# EAGLE design RCS (EAGLE 9.6.2)
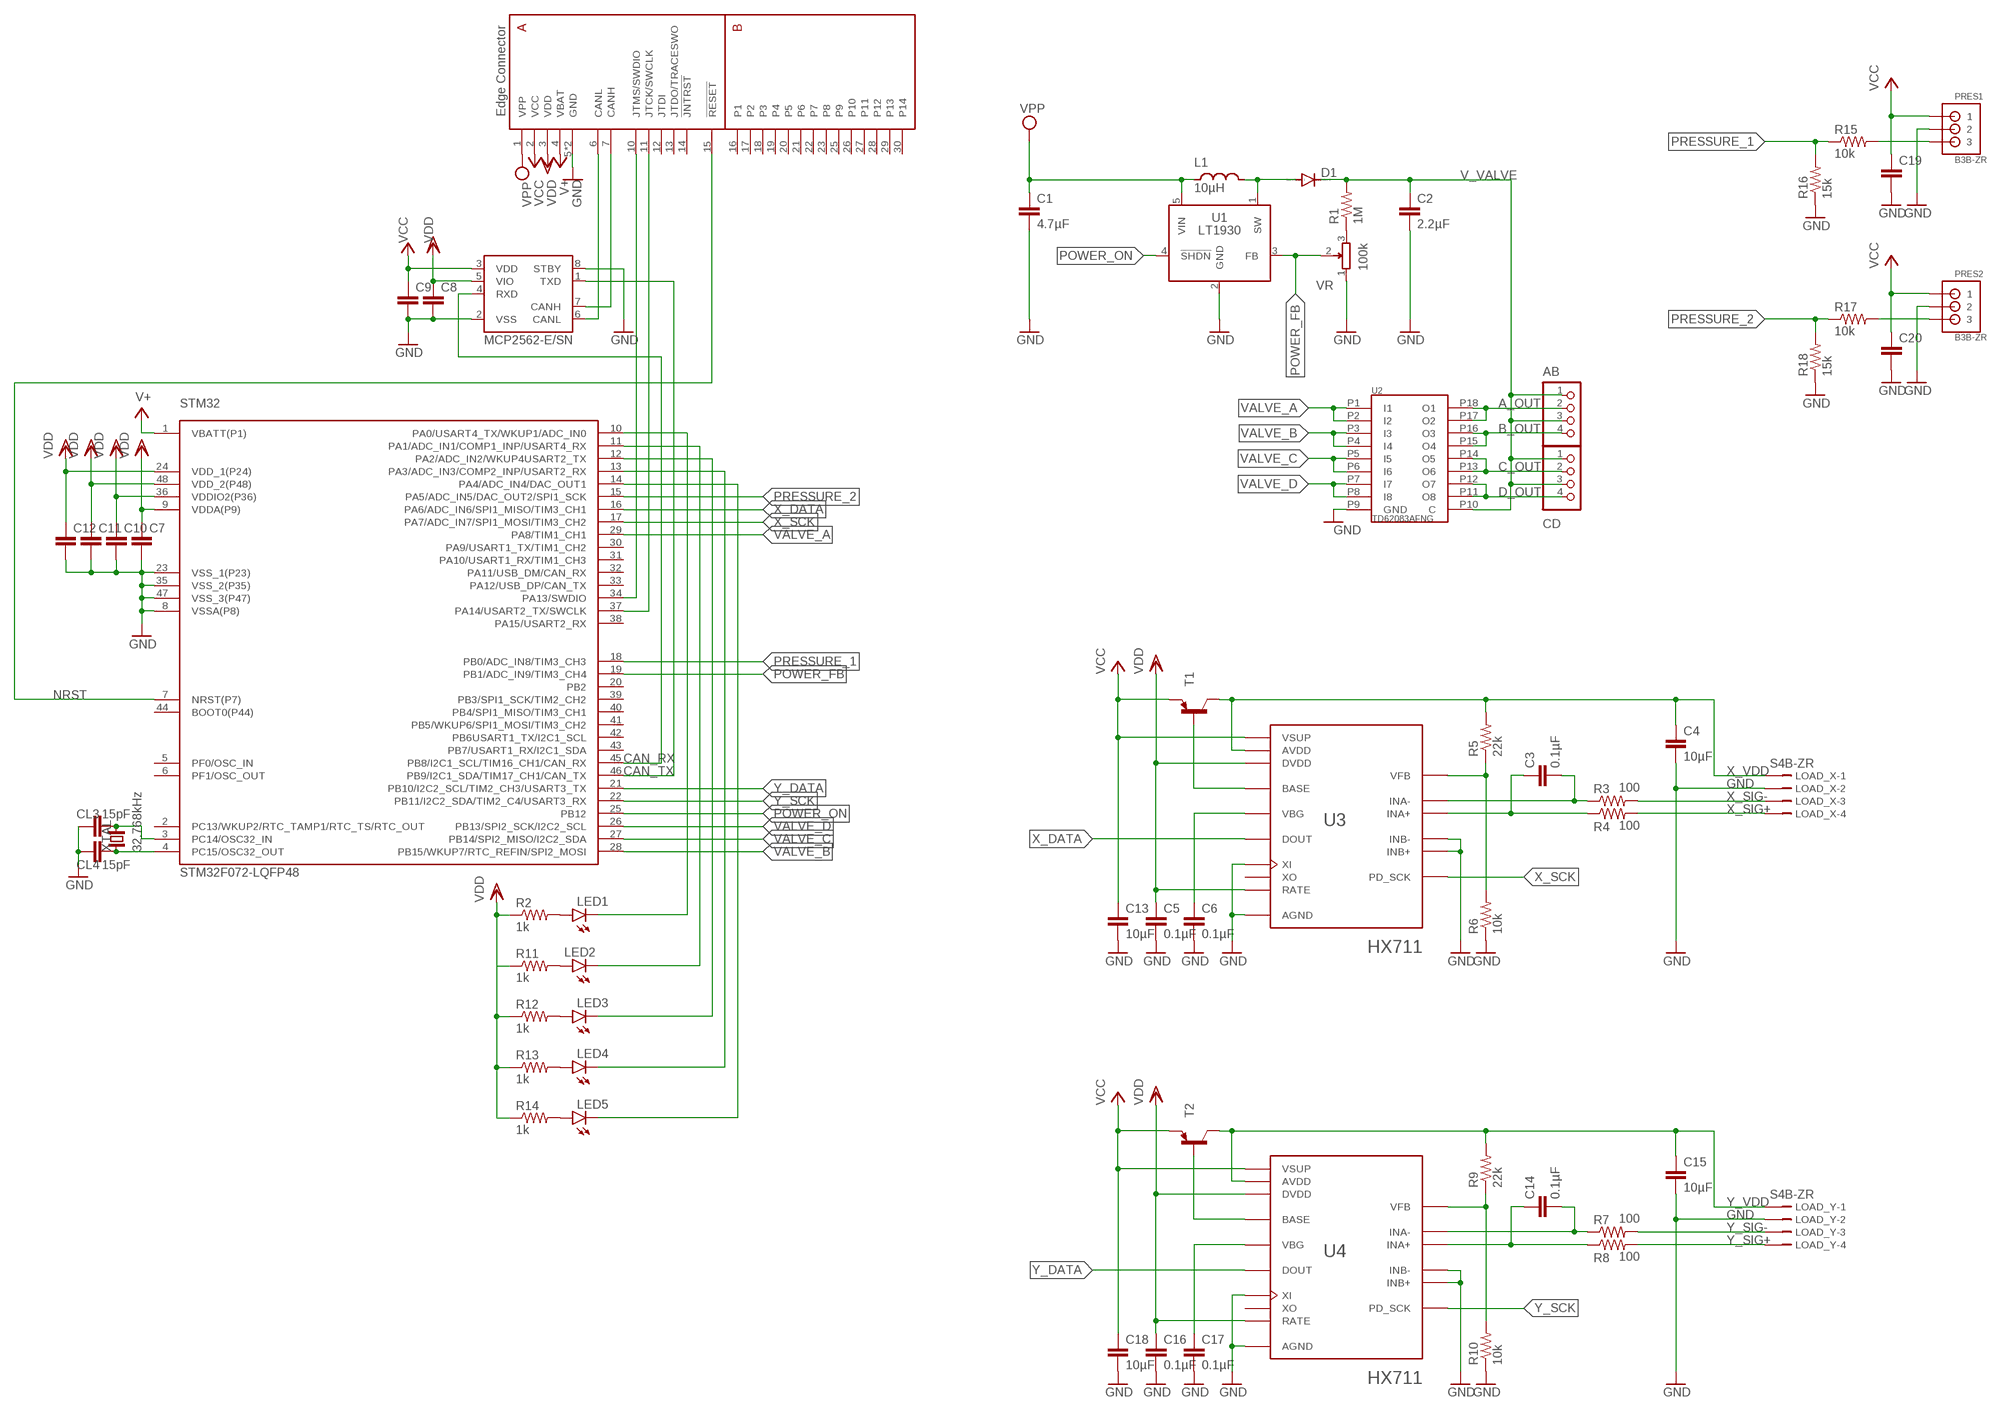
[diagram p0: schematic, sheet 1]

## Parts
AB  S4B-PH-K-S  [S4B-PH-K-S]
C1  4.7µF  C-EUC0603  [C0603]
C2  2.2µF  C-EUC0603  [C0603]
C3  0.1µF  C-EUC0603  [C0603]
C4  10µF  C-EUC0603  [C0603]
C5  0.1µF  C-EUC0603  [C0603]
C6  0.1µF  C-EUC0603  [C0603]
C7  C-EUC0603K  [C0603K]
C8  C-EUC0603K  [C0603K]
C9  C-EUC0603K  [C0603K]
C10  C-EUC0603K  [C0603K]
C11  C-EUC0603K  [C0603K]
C12  C-EUC0603K  [C0603K]
C13  10µF  C-EUC0603  [C0603]
C14  0.1µF  C-EUC0603  [C0603]
C15  10µF  C-EUC0603  [C0603]
C16  0.1µF  C-EUC0603  [C0603]
C17  0.1µF  C-EUC0603  [C0603]
C18  10µF  C-EUC0603  [C0603]
C19  C-EUC0603  [C0603]
C20  C-EUC0603  [C0603]
CD  S4B-PH-K-S  [S4B-PH-K-S]
CL3  15pF  C-EUC0603K  [C0603K]
CL4  15pF  C-EUC0603K  [C0603K]
D1  DIODE-SOD123  [SOD123]
L1  10µH  NR10050  [NR10050]
LED1  LEDCHIP-LED0603  [CHIP-LED0603]
LED2  LEDCHIP-LED0603  [CHIP-LED0603]
LED3  LEDCHIP-LED0603  [CHIP-LED0603]
LED4  LEDCHIP-LED0603  [CHIP-LED0603]
LED5  LEDCHIP-LED0603  [CHIP-LED0603]
LOAD_X  S4B-ZR  [S4B-ZR]
LOAD_Y  S4B-ZR  [S4B-ZR]
MCP1  MCP2562-E/SN  [SOIC127P600X175-8N]
PRES1  B3B-ZR  [B3B-ZR]
PRES2  B3B-ZR  [B3B-ZR]
R1  1M  R-US_R0603  [R0603]
R2  1k  R-US_R0603  [R0603]
R3  100  R-US_R0603  [R0603]
R4  100  R-US_R0603  [R0603]
R5  22k  R-US_R0603  [R0603]
R6  10k  R-US_R0603  [R0603]
R7  100  R-US_R0603  [R0603]
R8  100  R-US_R0603  [R0603]
R9  22k  R-US_R0603  [R0603]
R10  10k  R-US_R0603  [R0603]
R11  1k  R-US_R0603  [R0603]
R12  1k  R-US_R0603  [R0603]
R13  1k  R-US_R0603  [R0603]
R14  1k  R-US_R0603  [R0603]
R15  10k  R-US_R0603  [R0603]
R16  15k  R-US_R0603  [R0603]
R17  10k  R-US_R0603  [R0603]
R18  15k  R-US_R0603  [R0603]
STM32  STM32F072-LQFP48  [LQFP48]
T1  BC857A-PNP-SOT23-BEC  [SOT23-BEC]
T2  BC857A-PNP-SOT23-BEC  [SOT23-BEC]
U1  LT1930  [SOT95P240X110-5N]
U2  TD62083AFNG  [SSOP18-P-225-0.65]
U3  HX711  [SOP127P600X180-16N]
U4  HX711  [SOP127P600X180-16N]
U$2  EDGE30  [EDGE30]
VR  100k  PVZ3A  [PVZ3A]
XTAL  32.768kHz  CRYTALFC-255  [FC-255]

## Nets
A_OUT: AB.2 U2.P17(O2) U2.P18(O1)
B_OUT: AB.4 U2.P15(O4) U2.P16(O3)
C_OUT: CD.2 U2.P13(O6) U2.P14(O5)
CAN_RX: MCP1.4(RXD) STM32.45(PB8/I2C1_SCL/TIM16_CH1/CAN_RX)
CAN_TX: MCP1.1(TXD) STM32.46(PB9/I2C1_SDA/TIM17_CH1/CAN_TX)
CANH1: MCP1.7(CANH) U$2.7(CANH)
CANL1: MCP1.6(CANL) U$2.6(CANL)
D_OUT: CD.4 U2.P11(O8) U2.P12(O7)
GND: C1.2 C2.2 C4.2 C5.2 C6.2 C7.2 C8.2 C9.2 C10.2 C11.2 C12.2 C13.2 C15.2 C16.2 C17.2 C18.2 C19.2 C20.2 CL3.1 CL4.1 LOAD_X.2 LOAD_Y.2 MCP1.2(VSS) MCP1.8(STBY) PRES1.2 PRES2.2 R6.1 R10.1 R16.1 R18.1 STM32.8(VSSA(P8)) STM32.23(VSS_1(P23)) STM32.35(VSS_2(P35)) STM32.47(VSS_3(P47)) U1.2(GND) U2.P9(GND) U3.5(AGND) U3.9(INB-) U3.10(INB+) U3.14(XI) U4.5(AGND) U4.9(INB-) U4.10(INB+) U4.14(XI) U$2.5(GND) U$2.8(GND) VR.1
N$1: R1.1 VR.3
N$2: D1.A L1.2 U1.1(SW)
N$3: C3.2 R3.1 U3.7(INA-)
N$4: C3.1 R4.1 U3.8(INA+)
N$5: R5.1 R6.2 U3.4(VFB)
N$6: T1.B U3.2(BASE)
N$7: C6.1 U3.6(VBG)
N$8: PRES2.3 R17.2
N$11: C14.2 R7.1 U4.7(INA-)
N$13: C14.1 R8.1 U4.8(INA+)
N$14: T2.B U4.2(BASE)
N$15: C17.1 U4.6(VBG)
N$16: R9.1 R10.2 U4.4(VFB)
N$17: PRES1.3 R15.2
N$20: LED3.C STM32.12(PA2/ADC_IN2/WKUP4USART2_TX)
N$21: LED3.A R12.2
N$22: LED4.C STM32.13(PA3/ADC_IN3/COMP2_INP/USART2_RX)
N$23: LED4.A R13.2
N$25: LED5.C STM32.14(PA4/ADC_IN4/DAC_OUT1)
N$26: LED5.A R14.2
N$27: CL3.2 STM32.3(PC14/OSC32_IN) XTAL.2
N$29: LED2.C STM32.11(PA1/ADC_IN1/COMP1_INP/USART4_RX)
N$30: LED2.A R11.2
N$51: LED1.C STM32.10(PA0/USART4_TX/WKUP1/ADC_IN0)
N$71: CL4.2 STM32.4(PC15/OSC32_OUT) XTAL.1
N$74: LED1.A R2.2
NRST: STM32.7(NRST(P7)) U$2.15(!RESET!)
POWER_FB: STM32.19(PB1/ADC_IN9/TIM3_CH4) U1.3(FB) VR.2
POWER_ON: STM32.25(PB12) U1.4(!SHDN!)
PRESSURE_1: R15.1 R16.2 STM32.18(PB0/ADC_IN8/TIM3_CH3)
PRESSURE_2: R17.1 R18.2 STM32.15(PA5/ADC_IN5/DAC_OUT2/SPI1_SCK)
SWCLK1: STM32.37(PA14/USART2_TX/SWCLK) U$2.11(JTCK/SWCLK)
SWDIO1: STM32.34(PA13/SWDIO) U$2.10(JTMS/SWDIO)
V+: STM32.1(VBATT(P1))
V_VALVE: AB.1 AB.3 C2.1 CD.1 CD.3 D1.C R1.2 U2.P10(C)
VALVE_A: STM32.29(PA8/TIM1_CH1) U2.P1(I1) U2.P2(I2)
VALVE_B: STM32.28(PB15/WKUP7/RTC_REFIN/SPI2_MOSI) U2.P3(I3) U2.P4(I4)
VALVE_C: STM32.27(PB14/SPI2_MISO/I2C2_SDA) U2.P5(I5) U2.P6(I6)
VALVE_D: STM32.26(PB13/SPI2_SCK/I2C2_SCL) U2.P7(I7) U2.P8(I8)
VBAT: U$2.4(VBAT) ; supply symbol labelled V+
VCC: C9.1 C13.1 C18.1 C19.1 C20.1 MCP1.3(VDD) PRES1.1 PRES2.1 T1.E T2.E U3.1(VSUP) U4.1(VSUP) U$2.2(VCC)
VDD: C5.1 C7.1 C8.1 C10.1 C11.1 C12.1 C16.1 MCP1.5(VIO) R2.1 R11.1 R12.1 R13.1 R14.1 STM32.9(VDDA(P9)) STM32.24(VDD_1(P24)) STM32.36(VDDIO2(P36)) STM32.48(VDD_2(P48)) U3.15(RATE) U3.16(DVDD) U4.15(RATE) U4.16(DVDD) U$2.3(VDD)
VPP: C1.1 L1.1 U1.5(VIN) U$2.1(VPP)
X_DATA: STM32.16(PA6/ADC_IN6/SPI1_MISO/TIM3_CH1) U3.12(DOUT)
X_SCK: STM32.17(PA7/ADC_IN7/SPI1_MOSI/TIM3_CH2) U3.11(PD_SCK)
X_SIG+: LOAD_X.4 R4.2
X_SIG-: LOAD_X.3 R3.2
X_VDD: C4.1 LOAD_X.1 R5.2 T1.C U3.3(AVDD)
Y_DATA: STM32.21(PB10/I2C2_SCL/TIM2_CH3/USART3_TX) U4.12(DOUT)
Y_SCK: STM32.22(PB11/I2C2_SDA/TIM2_C4/USART3_RX) U4.11(PD_SCK)
Y_SIG+: LOAD_Y.4 R8.2
Y_SIG-: LOAD_Y.3 R7.2
Y_VDD: C15.1 LOAD_Y.1 R9.2 T2.C U4.3(AVDD)
Unconnected: STM32.2(PC13/WKUP2/RTC_TAMP1/RTC_TS/RTC_OUT) STM32.5(PF0/OSC_IN) STM32.6(PF1/OSC_OUT) STM32.20(PB2) STM32.30(PA9/USART1_TX/TIM1_CH2) STM32.31(PA10/USART1_RX/TIM1_CH3) STM32.32(PA11/USB_DM/CAN_RX) STM32.33(PA12/USB_DP/CAN_TX) STM32.38(PA15/USART2_RX) STM32.39(PB3/SPI1_SCK/TIM2_CH2) STM32.40(PB4/SPI1_MISO/TIM3_CH1) STM32.41(PB5/WKUP6/SPI1_MOSI/TIM3_CH2) STM32.42(PB6USART1_TX/I2C1_SCL) STM32.43(PB7/USART1_RX/I2C1_SDA) STM32.44(BOOT0(P44)) U3.13(XO) U4.13(XO) U$2.12(JTDI) U$2.13(JTDO/TRACESWO) U$2.14(!JNTRST!) U$2.16(P1) U$2.17(P2) U$2.18(P3) U$2.19(P4) U$2.20(P5) U$2.21(P6) U$2.22(P7) U$2.23(P8) U$2.25(P9) U$2.26(P10) U$2.27(P11) U$2.28(P12) U$2.29(P13) U$2.30(P14)

## Library data of the parts
AB CD = jst-ph:S4B-PH-*: Wire-to-Board 2.0mm pitch side mount connector Source: http://www.jst-mfg.com/product/pdf/jpn/PH.pdf http://www.jst-mfg.com/product/detail.php?series=199
C1-C20 CL3 CL4 = rcl:C-EU: CAPACITOR, European symbol; SPICEPREFIX: C
D1 = diode:DIODE-: DIODE
L1 = inductors:NR10050
LED1-LED5 = led:LED: LED OSRAM: - CHIPLED LG R971, LG N971, LY N971, LG Q971, LY Q971, LO R971, LY R971 LH N974, LH R974 LS Q976, LO Q976, LY Q976 LO Q996 - Hyper CHIPLED LW Q18S LB Q993, LB Q99A, LB R99A - SideLED LS A670, LO A670, LY A670, LG A670, LP A670 LB A673, LV A673, LT A673, LW A673 LH A674 LY A675 LS A676, LA A676, LO A676, LY A676, LW A676 LS A679, LY A679, LG A679 - Hyper Micro SIDELED® LS Y876, LA Y876, LO Y876, LY Y876 LT Y87S - SmartLED LW L88C, LW L88S LB L89C, LB L89S, LG L890 LS L89K, LO L89K, LY L89K LS L896, LA L896, LO L896, LY L896 - TOPLED LS T670, LO T670, LY T670, LG T670, LP T670 LSG T670, LSP T670, LSY T670, LOP T670, LYG T670 LG T671, LOG T671, LSG T671 LB T673, LV T673, LT T673, LW T673 LH T674 LS T676, LA T676, LO T676, LY T676, LB T676, LH T676, LSB T676, LW T676 LB T67C, LV T67C, LT T67C, LS T67K, LO T67K, LY T67K, LW E67C LS E67B, LA E67B, LO E67B, LY E67B, LB E67C, LV E67C, LT E67C LW T67C LS T679, LY T679, LG T679 LS T770, LO T770, LY T770, LG T770, LP T770 LB T773, LV T773, LT T773, LW T773 LH T774 LS E675, LA E675, LY E675, LS T675 LS T776, LA T776, LO T776, LY T776, LB T776 LHGB T686 LT T68C, LB T68C - Hyper Mini TOPLED® LB M676 - Mini TOPLED Santana® LG M470 LS M47K, LO M47K, LY M47K Source: http://www.osram.convergy.de LUXEON: - LUMILED® LXK2-PW12-R00, LXK2-PW12-S00, LXK2-PW14-U00, LXK2-PW14-V00 LXK2-PM12-R00, LXK2-PM12-S00, LXK2-PM14-U00 LXK2-PE12-Q00, LXK2-PE12-R00, LXK2-PE12-S00, LXK2-PE14-T00, LXK2-PE14-U00 LXK2-PB12-K00, LXK2-PB12-L00, LXK2-PB12-M00, LXK2-PB14-N00, LXK2-PB14-P00, LXK2-PB14-Q00 LXK2-PR12-L00, LXK2-PR12-M00, LXK2-PR14-Q00, LXK2-PR14-R00 LXK2-PD12-Q00, LXK2-PD12-R00, LXK2-PD12-S00 LXK2-PH12-R00, LXK2-PH12-S00 LXK2-PL12-P00, LXK2-PL12-Q00, LXK2-PL12-R00 Source: www.luxeon.com KINGBRIGHT: KA-3528ASYC Source: www.kingbright.com
LOAD_X LOAD_Y = con-jst:?4B-ZR: ZH CONNECTOR 1.5 mm, 4 pin 1 row Source: http://www.jst.com .. eZH.pdf; MF: FARNELL; MPN: S4B-ZR(LF)(SN); OC_FARNELL: 9491830; OC_NEWARK: 38K8076
MCP1 = mcp2562-E_SN:MCP2562-E/SN: MCP2562 Series 5 V Surface Mount High-Speed CAN Transceiver - SOIC-8; AVAILABILITY: Unavailable; DESCRIPTION: Microchip MCP2562-E/SN, CAN Transceiver 1MBps 1-channel IEC 61000-4-2, 8-Pin SOIC; MF: Microchip; MP: MCP2562-E/SN; PACKAGE: SO-8 Microchip; PRICE: None
PRES1 PRES2 = jst:B3B-ZR: JST-ZH Connector 3 pol, 1.5mm pitch Package: B3B-ZR Source: http://www.jst-mfg.com/product/pdf/eng/eZH.pdf
R1-R18 = rcl:R-US_: RESISTOR, American symbol; SPICEPREFIX: R
STM32 = stm32f0:STM32F072
T1 T2 = transistor:*-PNP-: PNP Transistror
U1 = dcdc:LT1930
U2 = transistors:TD62083AFNG
U3 U4 = HX711:HX711: Check availability <https://pricing.snapeda.com/parts/HX711/AVIA%20SEMICONDUCTOR/view-part?ref=eda>; AVAILABILITY: Not in stock; DESCRIPTION: Precision 24-bit analog-to-digital converter (ADC) designed for weigh scales and industrial control applications to interface directly with a bridge sensor.; MF: AVIA SEMICONDUCTOR; MP: HX711; PACKAGE: None; PRICE: None
U$2 = bus:EDGE30
VR = potentiometers:PVZ3A
XTAL = crystal':CRYTAL: CRYSTAL

## Board
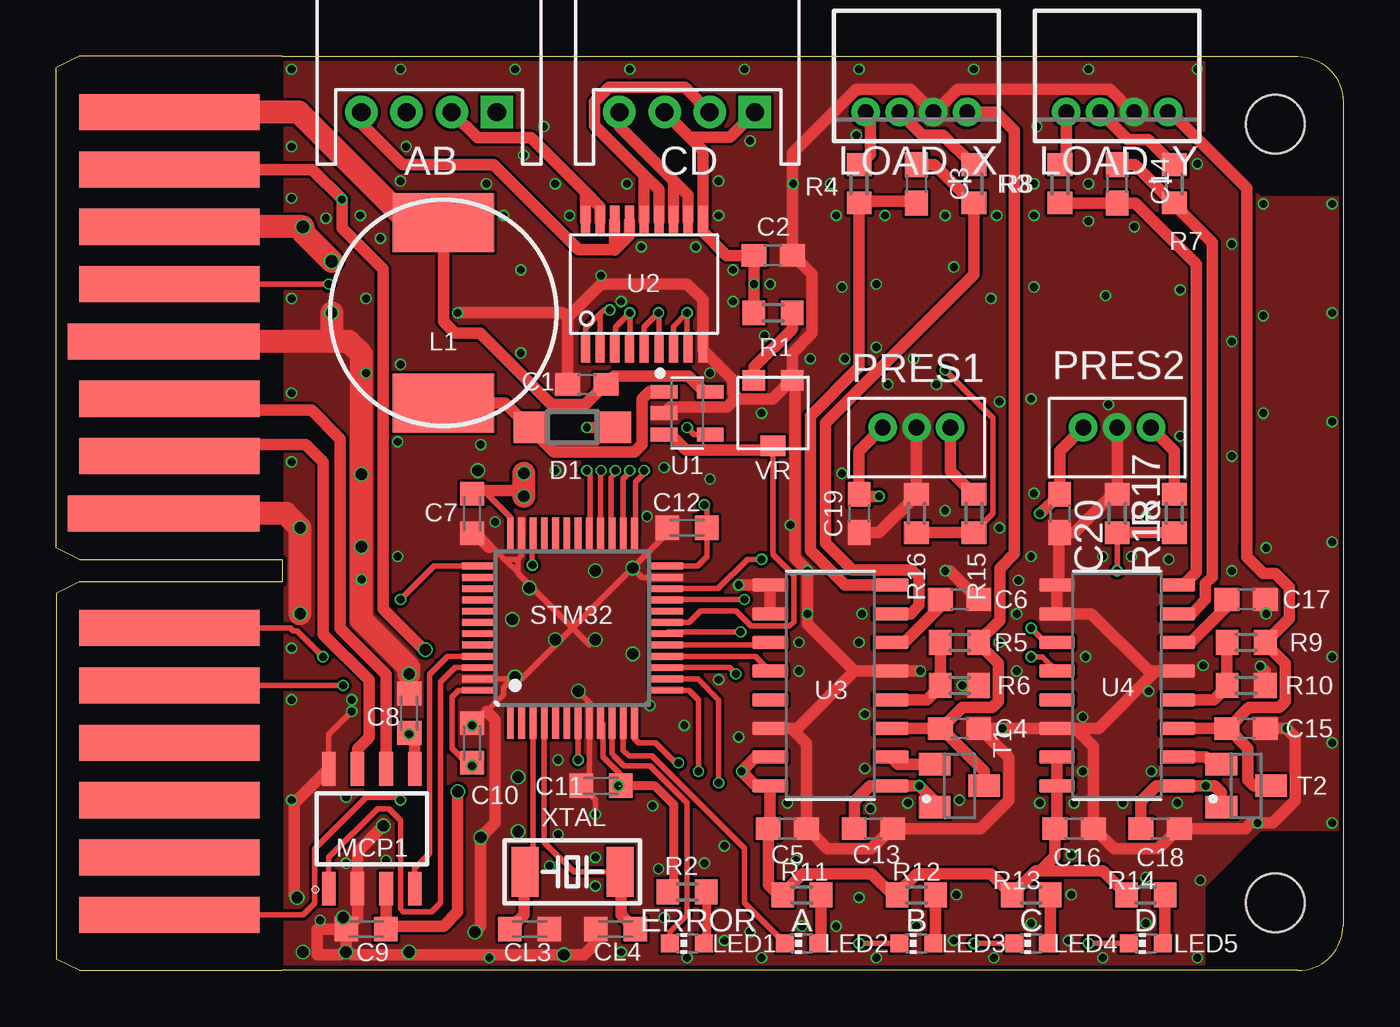
[diagram p1: board, top side]
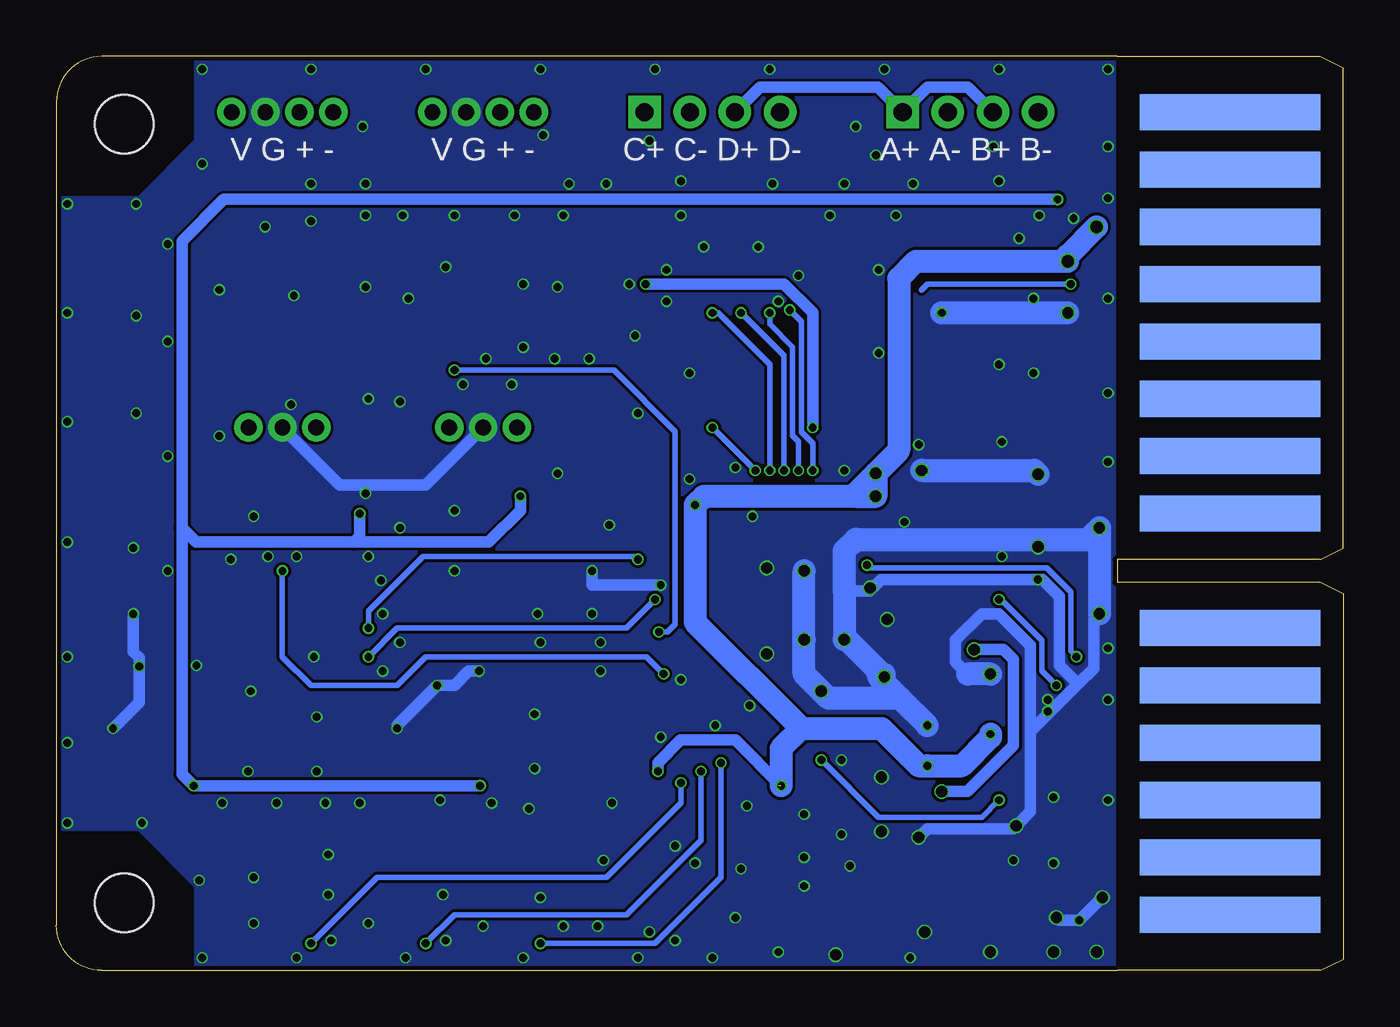
[diagram p2: board, bottom side, seen from below]

Size 57 x 40.5 mm. Coordinates in mm from the lower left corner, seen from the top.
Outline: 10,40.5 55,40.5 arc-90 57,38.5 57,2 arc-90 55,0 10,0
Copper layers (1*16): Top 0.035mm / dielectric 1.6mm / Bottom 0.035mm
Design rules "jlcpcb-2layers_": minimum track width 5mil, minimum drill 0.3mm, track to track 5mil, track to pad 5mil, pad to pad 5mil, via to via 5mil, smd to smd 5mil, copper to edge 0.2mm, drill to drill 6mil, minimum pad ring 10mil, minimum via ring 3mil, stop-mask expansion 4mil, vias tented up to drill 100mil, thermal gap 10mil
Holes 2.6 mm at 54,3 54,37.5

### Footprints (pad centres in the part's own frame; a part is rotated, then mirrored left to right if it is on the bottom)
S4B-PH-K-S = drill 0.8 square: 1 3,0 | drill 0.8: 2 1,0; 3 -1,0; 4 -3,0
C0603 = smd 1.1 x 1: 1 -0.85,0; 2 0.85,0
C0603K = smd 1.05 x 1.08: 1 -0.875,0; 2 0.875,0
SOD123 = smd 1.4 x 1.4: A 1.9,0; C -1.9,0
NR10050 = smd 2.6 x 4.5: 1 -4,0; 2 4,0
CHIP-LED0603 = smd 0.8 x 0.8: A 0,-0.75; C 0,0.75
S4B-ZR = drill 0.7 pad 1.1: 1 -2.25,0; 2 -0.75,0; 3 0.75,0; 4 2.25,0
SOIC127P600X175-8N = smd 1.5 x 0.6: 1 -2.65,1.905; 2 -2.65,0.635; 3 -2.65,-0.635; 4 -2.65,-1.905; 5 2.65,-1.905; 6 2.65,-0.635; 7 2.65,0.635; 8 2.65,1.905
B3B-ZR = drill 0.7 pad 1.1: 1 -1.5,0; 2 0,0; 3 1.5,0
R0603 = smd 1 x 1.1: 1 -0.85,0; 2 0.85,0
LQFP48 = smd 1.5 x 0.3: 1 -4.15,2.75; 2 -4.15,2.25; 3 -4.15,1.75; 4 -4.15,1.25; 5 -4.15,0.75; 6 -4.15,0.25; 7 -4.15,-0.25; 8 -4.15,-0.75; 9 -4.15,-1.25; 10 -4.15,-1.75; 11 -4.15,-2.25; 12 -4.15,-2.75; 25 4.15,-2.75; 26 4.15,-2.25; 27 4.15,-1.75; 28 4.15,-1.25; 29 4.15,-0.75; 30 4.15,-0.25; 31 4.15,0.25; 32 4.15,0.75; 33 4.15,1.25; 34 4.15,1.75; 35 4.15,2.25; 36 4.15,2.75 | smd 0.3 x 1.5: 13 -2.75,-4.15; 14 -2.25,-4.15; 15 -1.75,-4.15; 16 -1.25,-4.15; 17 -0.75,-4.15; 18 -0.25,-4.15; 19 0.25,-4.15; 20 0.75,-4.15; 21 1.25,-4.15; 22 1.75,-4.15; 23 2.25,-4.15; 24 2.75,-4.15; 37 2.75,4.15; 38 2.25,4.15; 39 1.75,4.15; 40 1.25,4.15; 41 0.75,4.15; 42 0.25,4.15; 43 -0.25,4.15; 44 -0.75,4.15; 45 -1.25,4.15; 46 -1.75,4.15; 47 -2.25,4.15; 48 -2.75,4.15
SOT23-BEC = smd 1 x 1.4: B -0.95,-1.1; C 0,1.1; E 0.95,-1.1
SOT95P240X110-5N = smd 1.18 x 0.609: 1 -1.024,0.95; 2 -1.024,0; 3 -1.024,-0.95; 4 1.024,-0.95; 5 1.024,0.95
SSOP18-P-225-0.65 = smd 1.35 x 0.4: P1 -2.8,2.6; P2 -2.8,1.95; P3 -2.8,1.3; P4 -2.8,0.65; P5 -2.8,0; P6 -2.8,-0.65; P7 -2.8,-1.3; P8 -2.8,-1.95; P9 -2.8,-2.6; P10 2.8,-2.6; P11 2.8,-1.95; P12 2.8,-1.3; P13 2.8,-0.65; P14 2.8,0; P15 2.8,0.65; P16 2.8,1.3; P17 2.8,1.95; P18 2.8,2.6
SOP127P600X180-16N = smd 1.58 x 0.59: 1 -2.67,4.445; 2 -2.67,3.175; 3 -2.67,1.905; 4 -2.67,0.635; 5 -2.67,-0.635; 6 -2.67,-1.905; 7 -2.67,-3.175; 8 -2.67,-4.445; 9 2.67,-4.445; 10 2.67,-3.175; 11 2.67,-1.905; 12 2.67,-0.635; 13 2.67,0.635; 14 2.67,1.905; 15 2.67,3.175; 16 2.67,4.445
EDGE30 = smd 1.6 x 8: 1 -17.78,-5; 2 -15.24,-5; 3 -12.7,-5; 4 -10.16,-5; 6 -5.08,-5; 7 -2.54,-5; 10 5.08,-5; 11 7.62,-5; 12 10.16,-5; 13 12.7,-5; 14 15.24,-5; 15 17.78,-5 | smd 1.6 x 8.5: 5 -7.62,-5.25; 8 0,-5.25 | smd 1.6 x 8 bottom: 16 -17.78,-5; 17 -15.24,-5; 18 -12.7,-5; 19 -10.16,-5; 20 -7.62,-5; 21 -5.08,-5; 22 -2.54,-5; 23 0,-5; 25 5.08,-5; 26 7.62,-5; 27 10.16,-5; 28 12.7,-5; 29 15.24,-5; 30 17.78,-5
PVZ3A = smd 1 x 0.9: 1 -0.85,-1.45; 3 0.85,-1.45 | smd 1.1 x 0.9: 2 0,1.45
FC-255 = smd 1.2 x 2.2: 1 -2.1,0; 2 2.1,0

### Placement (x,y rotation side)
AB  16.51,38.03 0 top
C1  23.5,25.96 180 top
C2  31.75,31.68 0 top
C3  38.1,34.85 90 top
C4  40.01,10.72 0 top
C5  32.38,6.28 0 top
C6  40.01,16.44 0 top
C7  18.41,20.25 270 top
C8  15.63,11.41 90 top
C9  13.72,1.83 180 top
C10  18.41,10.09 90 top
C11  24.13,8.19 180 top
C12  27.94,19.61 180 top
C13  36.2,6.28 0 top
C14  46.99,34.85 90 top
C15  52.7,10.72 0 top
C16  45.09,6.28 0 top
C17  52.7,16.44 0 top
C18  48.9,6.28 0 top
C19  35.56,20.25 270 top
C20  44.45,20.25 270 top
CD  27.94,38.03 0 top
CL3  20.95,1.83 180 top
CL4  24.77,1.83 0 top
D1  22.86,24.06 180 top
L1  17.14,29.14 270 top
LED1  27.94,1.2 90 top
LED2  33.02,1.2 90 top
LED3  38.1,1.2 90 top
LED4  43.18,1.2 90 top
LED5  48.26,1.2 90 top
LOAD_X  38.1,38.03 180 top
LOAD_Y  46.99,38.03 180 top
MCP1  13.97,6.28 90 top
PRES1  38.1,24.06 0 top
PRES2  46.99,24.06 0 top
R1  31.75,29.14 180 top
R2  27.94,3.49 0 top
R3  40.64,34.85 90 top
R4  35.56,34.85 90 top
R5  40.01,14.54 0 top
R6  40.01,12.63 180 top
R7  49.53,34.85 90 top
R8  44.45,34.85 90 top
R9  52.7,14.54 0 top
R10  52.7,12.63 180 top
R11  33.02,3.36 0 top
R12  38.1,3.36 0 top
R13  43.18,3.36 0 top
R14  48.26,3.36 0 top
R15  40.64,20.25 90 top
R16  38.1,20.25 270 top
R17  49.53,20.25 90 top
R18  46.99,20.25 270 top
STM32  22.86,15.17 90 top
T1  40.01,8.19 270 top
T2  52.7,8.19 270 top
U1  27.94,24.7 0 top
U2  26.04,30.41 90 top
U3  34.29,12.63 180 top
U4  46.99,12.63 180 top
U$2  10,20.25 270 top
VR  31.75,24.7 180 top
XTAL  22.86,4.38 180 top

### Tracks (layer width: path | path; a pad name or v marks a point on that pad's centre or on a via)
A_OUT
  Top 0.508: U2.P18 23.43,34.48 | 23.43,34.48 21.02,36.89 18.65,36.89 AB.2 | U2.P17 24.09,33.83 23.43,34.48
B_OUT
  Top 0.508: U2.P16 24.73,31.94 | 24.73,31.94 24.73,31.93 25.39,32.58 U2.P15 | 24.73,31.94 23.13,31.94 19.37,35.7 15.33,35.7 13.51,37.52 AB.4
C_OUT
  Top 0.508: U2.P14 26.04,35.24 | CD.2 27.84,39.13 24.48,39.13 23.84,38.49 23.84,37.43 26.04,35.24 | 26.04,35.24 26.68,34.59 U2.P13
CAN_RX
  Top 0.254: MCP1.4 15.88,4.52 16.54,5.18 16.54,13.13 17.33,13.92 STM32.45
CAN_TX
  Top 0.254: MCP1.1 12.06,5.01 14.22,7.17 14.73,7.17 15.24,6.66 15.24,2.72 15.37,2.6 16.61,2.6 17.02,3 17.02,12.78 17.66,13.42 STM32.46
CANH1
  Top 0.508: MCP1.7 13.34,9.82 13.84,10.33 13.84,12.87 11.81,14.9 11.81,22.54 11.05,23.3 5.51,23.3 U$2.7
CANL1
  Top 0.508: MCP1.6 14.61,13.12 12.57,15.15 12.57,23.55 11.3,24.82 5.51,24.82 U$2.6
D_OUT
  Top 0.508: CD.4 24.94,37.4 27.34,35 | 27.34,35 U2.P12 | 27.34,35 27.98,34.35 U2.P11
GND  (via drill 0.35, 0.5)
  Top 0.254: 20.45,18.22 20.61,18.38 STM32.35 | 20.45,17.63 20.45,18.22 | 20.19,12.92 20.61,12.92 22.86,15.17 | 22.86,15.17 20.45,17.58 20.45,17.63 | 23.61,14.42 22.86,15.17 | 22.86,15.17 v25.53,17.84 | 19.16,11.47 19.06,11.47 19.81,12.22 19.81,12.54 20.19,12.92 | 19.18,18.74 19.34,18.74 19.86,18.22 | 20.45,18.22 19.86,18.22 | 19.86,18.22 20.45,17.63 | MCP1.8 12.06,10.47 v13.08,11.49 | C12.2 27.07,19.38 v25.53,17.84 | STM32.23 25.94,17.42 v25.53,17.84 | STM32.47 20.19,12.92 | v23.88,6.92 23.88,7.56 C11.2 23.62,8.55 23.62,9.54 23.61,9.55 STM32.8 23.61,11.88 v23.11,12.38
  Top 0.508: C9.2 13.34,2.33 MCP1.2 13.34,5.26 v14.48,6.41 | 12.84,0.95 13.1,0.69 v22.48,0.69 | C9.2 12.84,0.95 | 19.06,11.47 19.43,11.11 19.43,6.53 v18.8,5.9 18.8,1.96 v18.54,1.71 | v15.62,13.14 v15.63,13.13 C8.2 | v22.48,0.69 23.37,0.69 23.89,1.21 CL4.1 | 23.25,0.71 23.24,0.69 | v22.48,0.69 21.7,0.69 | C9.2 11.56,1.83 11.56,0.69 12.59,0.69 12.84,0.95 | MCP1.8 10.54,7.41 10.54,3.36 v10.67,3.23 | U4.14 v41.91,10.72 C4.2 40.91,10.72 42.19,9.44 42.19,7.53 40.94,6.28 C13.2 36.99,6.28 36.11,5.4 34.17,5.4 33.28,6.28 C5.2 33.23,10.06 32.57,10.72 U3.14 32.82,10.72 35.36,13.27 | U3.10 U3.9 v30.23,17.07 | VR.1 32.6,27.36 33.48,28.25 33.48,30.85 32.65,31.68 C2.2 32.6,36.21 35.43,39.04 37.84,39.04 LOAD_X.2 38.92,38.03 39.93,39.04 46.66,39.04 47.67,38.03 LOAD_Y.2 | VR.1 32.55,26.14 31.72,25.31 30.24,25.31 | 30.24,25.31 29.98,25.58 29.98,26.15 28.64,27.49 U2.P9 28.64,29.71 27.94,30.41 24.13,30.41 22.64,28.93 | U4.14 45.14,10.72 45.94,9.93 C16.2 45.98,6.28 46.87,5.4 48.81,5.4 49.7,6.28 C18.2 52.67,6.28 52.92,6.53 53.89,6.53 54.89,7.53 54.89,10.33 v54.49,10.72 C15.2 | 35.36,13.27 U3.5 v38.28,13.27 | U4.14 46.17,10.72 48.71,13.27 U4.5 48.39,13.27 45.85,15.8 U4.10 U4.9 44.41,17.17 44.41,19.36 C20.2 45.09,19.4 46.78,21.1 R18.1 PRES2.2 | U1.2 27.18,24.96 29.71,24.96 30.07,25.31 30.24,25.31 | C1.2 22.64,28.93 | C6.2 39.59,17.71 v39.37,17.71 | 35.36,13.27 33.27,15.35 v33.27,17.71 33.27,17.72 32.73,18.27 32.73,26.02 VR.1 | R6.1 v40.13,12.63 | v17.78,29.14 22.43,29.14 22.64,28.93 | C7.2 18.54,19.38 19.18,18.74 | C17.2 53.55,15.84 v53.59,15.8 | v53.34,13.48 53.55,13.27 R10.1 | C19.2 36.45,19.4 38.1,21.05 R16.1 PRES1.2
  Top 1.016: U$2.8 10.16,20.25 v10.79,19.61 v10.79,15.8 | 12.19,27.87 12.95,27.87 13.51,27.31 v13.51,21.98 v13.51,18.77 v13.51,17.32 13.51,15.53 15.62,13.42 v15.62,13.14 | 12.19,27.87 U$2.5 | v12.19,29.14 12.19,27.87
  Bottom 0.508: 16.64,13.14 17.17,13.67 17.17,14.64 16,15.8 15.24,15.8 13.84,14.41 13.84,10.6 | 13.84,10.6 13.84,7.04 v14.48,6.41 14.61,6.28 18.41,6.28 v18.8,5.9 | 13.84,10.6 11.75,12.69 | 11.75,12.69 11.05,13.39 11.05,15.55 v10.79,15.8 | 11.05,19.36 v10.79,19.61 | 22.1,16.82 20.95,16.82 20.46,17.32 v13.51,17.32 13.33,17.32 12.57,16.57 12.57,13.52 11.75,12.69 | v12.7,2.34 12.57,2.22 v11.68,2.22 v10.67,3.23 | v30.23,17.07 33.27,17.07 v33.27,17.71 | v41.91,10.72 41.91,10.85 v40.13,12.63 39.37,12.63 38.73,13.27 v38.28,13.27 | v53.59,15.8 53.59,14.12 53.34,13.86 v53.34,13.48 53.34,11.88 v54.49,10.72 | PRES1.2 40.64,21.52 44.45,21.52 PRES2.2
  Bottom 1.016: v15.62,13.14 16.64,13.14 | 19.62,12.06 20.57,13.01 20.57,13.14 20.32,13.14 v20.32,13.01 21.97,14.66 v22.1,14.66 22.1,16.82 22.1,18.6 21.59,19.11 11.3,19.11 v10.79,19.61 v10.79,15.8 | 19.62,12.06 v18.41,10.85 | 19.62,12.06 22.8,12.06 v23.11,12.38 23.88,13.14 v23.88,14.66 v23.88,17.71 | v13.51,21.98 13.69,22.16 v18.67,22.16 | v17.78,29.14 v12.19,29.14
  other vias: 20.45,8.57 20.45,6.15 10.92,0.82 12.83,0.82 20.95,16.95 20.19,15.55 25.53,14.03 15.62,0.82 42.62,17.28 50.55,39.94 56.52,33.97 53.47,33.97 45.72,34.85 45.72,39.94 40.64,39.94 35.56,39.94 30.48,39.94 25.4,39.94 20.32,39.94 15.24,39.94 10.41,39.94 15.24,34.98 19.05,34.85 10.41,34.22 10.41,36.51 10.41,29.77 10.41,25.58 15.49,36.51 20.7,36.12 22.1,34.85 22.73,33.46 25.27,34.85 21.59,37.4 29.34,34.98 30.73,36.76 34.29,34.85 35.43,37.01 32.64,34.85 43.43,37.4 43.31,34.85 47.75,32.95 56.52,29.14 56.52,24.31 56.52,18.98 56.52,13.9 56.52,10.09 56.52,6.53 53.21,6.53 50.67,3.99 50.55,0.56 52.07,32.19 49.78,30.16 50.55,35.74 45.72,33.2 41.4,29.77 39.37,33.46 43.31,33.46 41.66,33.46 43.31,30.28 46.61,25.08 48.26,20.12 47.62,18.34 43.31,21.14 43.18,25.33 49.78,23.68 36.32,30.41 53.59,18.73 53.47,24.7 53.47,29.01 48.26,2.09 44.96,3.36 46.35,0.56 41.53,0.56 36.32,0.56 31.24,0.56 27.94,0.56 25.02,0.82 41.78,19.61 37.97,27.11 36.7,33.46 34.54,33.46 29.34,33.46 28.32,32.06 25.91,32.06 29.97,31.04 29.97,29.65 25.02,29.65 24.13,30.79 19.81,33.46 20.57,31.04 13.72,26.47 15.24,26.85 15.11,23.43 18.8,23.3 22.1,22.16 19.43,19.87 15.11,18.34 10.41,22.54 10.41,14.28 10.41,11.99 13.08,11.99 10.41,7.55 12.83,7.68 12.83,4.76 14.61,4.88 19.18,0.56 21.84,4.63 23.88,3.74 23.88,5.01 22.23,6.03 22.23,9.33 26.42,7.3 26.67,4.5 26.92,2.34 28.7,4.76 29.59,5.52 30.73,1.71 29.59,1.33 35.56,3.23 33.02,1.96 34.54,1.96 38.1,1.96 39.88,3.36 43.18,2.09 39.75,1.33 44.83,1.33 44.96,5.14 48.26,4.12 47.24,7.42 45.09,7.42 49.66,7.42 43.56,7.42 40.01,7.55 37.72,7.42 36.07,7.17 32.77,4.88 32.38,7.42 35.81,8.95 35.81,11.36 30.23,10.34 29.34,12.88 27.81,10.85 26.29,11.74 33.27,15.8 35.56,14.54 35.69,15.8 39.37,20.38 34.8,22.03 36.32,27.62 36.83,25.96 28.96,21.77 26.92,22.28 26.16,20.12 31.24,24.7 33.4,27.11 31.37,28.12 28.96,26.47 38.99,25.96 39.75,31.17 46.35,18.34 41.78,14.54 42.55,15.8 42.55,13.27 49.28,18.22 46.48,29.9 31.62,30.41 20.57,27.36 45.59,13.9 50.8,13.52 48.51,8.82 45.47,8.82 45.47,11.23 48.39,12.38 43.18,18.34 32.51,19.74 32.89,14.54 34.93,27.11 41.78,25.2 34.8,30.28 11.94,33.33 13.46,33.46 14.35,32.44 13.72,29.77 52.07,27.87 52.07,22.79 52.07,17.71 32.89,13.27
  pour Top (no thermals): 10.16,45.65 10.16,-5.15 50.8,-5.15 50.8,3.74 53.34,6.28 58.42,6.28 58.42,34.22 53.34,34.22 50.8,36.76 50.8,45.65
  pour Bottom (no thermals): 10.16,45.65 10.16,-3.88 50.8,-3.88 50.8,3.74 53.34,6.28 63.5,6.28 63.5,34.22 53.34,34.22 50.8,36.76 50.8,45.65
N$1
  Top 0.508: R1.1 32.6,28.43 30.9,26.73 VR.3
N$2
  Top 0.508: U1.1 26.27,25.64 25.94,25.32 25.94,23.31 25.62,22.98 22.04,22.98 D1.A 19.88,25.14 L1.2
N$3
  Top 0.508: U3.7 37.85,15.8 38.2,16.19 38.2,17.46 37.91,17.75 35.27,17.75 34.07,18.95 34.07,24.26 40.64,30.83 R3.1 40.59,34.01 38.89,35.7 C3.2
N$4
  Top 0.508: U3.8 34.93,17.07 33.4,18.6 33.4,24.57 35.56,26.73 R4.1 35.65,34.09 38.02,34.09 C3.1
N$5
  Top 0.508: R5.1 R6.2 39.16,12.58 38.57,11.99 U3.4
N$6
  Top 0.508: T1.B 37.28,9.13 U3.2
N$7
  Top 0.508: C6.1 39.16,16.13 37.56,14.54 U3.6
N$8
  Top 0.508: PRES2.3 49.53,23.02 R17.2
N$11
  Top 0.508: U4.7 50.3,15.8 50.9,16.44 50.9,17.14 51.21,17.43 51.21,32.24 49.49,33.97 R7.1 49.48,34.01 47.78,35.7 C14.2
N$13
  Top 0.508: U4.8 49.91,17.07 50.5,17.66 50.5,31.31 47.8,34.01 C14.1 R8.1
N$14
  Top 0.508: T2.B 51.25,9.13 50.93,9.46 U4.2
N$15
  Top 0.508: C17.1 51.85,16.13 50.26,14.54 U4.6
N$16
  Top 0.508: R9.1 R10.2 51.85,12.58 51.27,11.99 U4.4
N$17
  Top 0.508: R15.2 39.6,22.14 PRES1.3
N$20  (via drill 0.35)
  Top 0.254: STM32.12 25.61,10.26 25.78,10.09 26.54,10.09 27.43,9.2 v27.56,9.2 | v35.56,1.2 LED3.C
  Bottom 0.254: v27.56,9.2 27.56,4.12 30.48,1.2 v35.56,1.2
N$21
  Top 0.508: R12.2 38.95,1.3 LED3.A
N$22  (via drill 0.35)
  Top 0.254: LED4.C v40.64,1.2 | v28.45,8.82 28.45,12 28.03,12.42 STM32.13
  Bottom 0.254: v40.64,1.2 39.37,2.47 31.75,2.47 28.45,5.77 v28.45,8.82
N$23
  Top 0.508: R13.2 44.03,1.3 LED4.A
N$25  (via drill 0.35)
  Top 0.254: v29.34,8.31 29.34,11.99 28.41,12.92 STM32.14 | v45.72,1.2 LED5.C
  Bottom 0.254: v29.34,8.31 29.34,7.42 32.64,4.12 42.8,4.12 v45.72,1.2
N$26
  Top 0.508: R14.2 49.11,1.3 LED5.A
N$27
  Top 0.254: STM32.3 21.11,4.72 XTAL.2
  Top 0.508: CL3.2 20.71,2.47 20.71,4.33 XTAL.2
N$29
  Top 0.254: STM32.11 25.11,9.75 25.36,9.51 26.39,9.51 30.48,5.42 30.48,2.99 LED2.C
N$30
  Top 0.508: R11.2 33.87,1.3 LED2.A
N$51
  Top 0.254: LED1.C 27.19,1.71 27.93,2.45 27.93,7.43 26.29,9.07 25.15,9.07 24.73,9.49 24.61,9.61 STM32.10
N$71
  Top 0.254: STM32.4 21.61,5.68 22.92,4.38 XTAL.1
  Top 0.508: XTAL.1 25,4.33 25,2.47 CL4.2
N$74
  Top 0.406: R2.2 28.79,1.3 LED1.A
NRST  (via drill 0.35)
  Top 0.254: v23.11,9.33 STM32.7 | U$2.15 10.92,2.47 11.43,2.98 11.43,5.39 13.72,7.68 15.11,7.68 v15.24,7.55
  Bottom 0.254: v23.11,9.33 20.57,6.79 16,6.79 v15.24,7.55
POWER_FB
  Top 0.254: STM32.19 28.03,15.42 28.53,15.93 30.1,15.93 30.77,15.26 32.47,15.26 32.66,15.45 32.66,17.51 31.75,18.42 VR.2
  Top 0.508: VR.2 31.56,23.06 27.89,23.06 27.2,23.75 U1.3
POWER_ON  (via drill 0.35)
  Top 0.254: U1.4 28.25,23.75 v27.94,24.06 | v26.04,22.16 26.04,22.03 25.65,21.65 25.65,19.36 STM32.25
  Bottom 0.254: v27.94,24.06 v26.04,22.16
PRESSURE_1  (via drill 0.35)
  Top 0.254: STM32.18 27.09,15 v30.31,15 | v39.37,26.6 41.49,24.48 41.49,20.25 R15.1
  Top 0.508: R16.2 R15.1
  Bottom 0.254: v39.37,26.6 32.31,26.6 29.59,23.89 29.59,15.34 29.94,15 v30.31,15
PRESSURE_2  (via drill 0.35)
  Top 0.254: STM32.15 29.82,13.42 v30.1,13.14 | v46.99,17.71 R18.2
  Top 0.508: R18.2 R17.1
  Bottom 0.254: v30.1,13.14 30.86,13.9 40.64,13.9 41.91,12.63 45.72,12.63 46.99,13.9 v46.99,17.71
SWCLK1  (via drill 0.35)
  Top 0.254: STM32.37 16.72,17.92 v15.24,16.44 | v12.7,12.63 U$2.11
  Bottom 0.254: v15.24,16.44 15.11,16.31 15.03,16.31 13.34,14.62 13.34,13.27 v12.7,12.63
SWDIO1  (via drill 0.35)
  Top 0.254: U$2.10 10.35,15.17 10.48,15.04 10.67,15.04 v11.81,13.9 | v21.09,17.96 v21.08,17.97 21.08,19.29 STM32.34
  Bottom 0.254: v11.81,13.9 12.06,14.15 12.06,16.78 13.12,17.83 20.95,17.83 v21.09,17.96
V_VALVE  (via drill 0.35)
  Top 0.508: R1.2 v30.9,30.41 C2.1 29.69,31.68 28.64,32.73 U2.P10 28.64,36.34 CD.3 28.04,36.93 29.84,36.93 CD.1 | D1.C v23.5,24.06
  Bottom 0.508: v23.5,24.06 23.5,29.14 24.77,30.41 v30.9,30.41 | AB.3 16.61,39.13 18.41,39.13 AB.1 20.61,39.13 25.84,39.13 CD.3
VALVE_A  (via drill 0.35)
  Top 0.254: U2.P2 24.09,29.09 | v24.51,29.26 24.25,29.26 24.09,29.09 | v23.5,22.16 23.64,22.01 23.64,19.35 STM32.29 | U2.P1 23.43,28.45 24.09,29.09
  Bottom 0.254: v24.51,29.26 24,28.75 24,23.85 23.5,23.34 v23.5,22.16
VALVE_B  (via drill 0.35)
  Top 0.254: STM32.28 24.11,22.13 v24.13,22.16 | U2.P3 24.77,27.64 24.77,28.5 v25.4,29.14 25.4,27.62 U2.P4
  Bottom 0.254: v24.13,22.16 24.13,23.44 24.38,23.69 24.38,27.62 25.4,28.63 v25.4,29.14
VALVE_C  (via drill 0.35)
  Top 0.254: U2.P5 26.04,28.5 v26.67,29.14 26.68,29.12 U2.P6 | v24.77,22.16 24.77,22.03 24.58,21.84 24.58,19.35 STM32.27
  Bottom 0.254: v26.67,29.14 24.77,27.23 v24.77,22.16
VALVE_D  (via drill 0.35)
  Top 0.254: v25.4,22.16 25.27,22.02 25.27,21.95 25.11,21.79 STM32.26 | U2.P8 27.94,27.66 v27.94,29.14 27.34,28.54 U2.P7
  Bottom 0.254: v25.4,22.16 25.4,26.85 27.69,29.14 v27.94,29.14
VBAT  (via drill 0.35)
  Top 0.254: v12.06,30.41 U$2.4
  Bottom 0.254: 18.67,30.16 18.41,30.41 v12.06,30.41
VCC  (via drill 0.35, 0.5)
  Top 0.508: MCP1.3 14.61,1.85 C9.1 14.72,1.96 17.14,1.96 17.78,2.6 v17.78,7.93 | v16.35,14.22 16.26,14.22 14.47,16.01 14.47,31.07 12.65,32.89 v12.65,34.17 11.32,35.49 U$2.2 | C18.1 48.05,7.5 48.73,8.19 U4.1 v50.93,8.19 51.31,8.19 51.6,7.89 T2.E | T1.E 38.91,7.51 v38.23,8.19 U3.1 36.03,8.19 35.34,7.5 C13.1 | PRES1.1 35.56,23.02 C19.1 35.56,21.01 v36.45,21.01 | PRES2.1 44.45,23.02 C20.1 43.6,20.25 v43.56,20.25
  Bottom 0.508: v17.78,7.93 16.64,7.93 14.61,9.96 14.61,13.77 15.05,14.22 v16.35,14.22 | v38.23,8.19 v50.93,8.19 51.44,8.69 51.44,19.61 | v12.65,34.17 49.58,34.17 51.44,32.31 51.44,19.61 | 51.44,19.61 50.8,18.98 43.81,18.98 | v36.45,21.01 36.45,20.38 37.85,18.98 43.81,18.98 | v43.56,20.25 43.56,19.23 43.81,18.98
VDD  (via drill 0.35, 0.5, 0.55)  (1 unrouted)
  Top 0.254: STM32.24 28.39,17.92 28.82,18.34 C12.1 28.82,20.52 v28.7,20.63 | STM32.48 17.82,12.42 17.53,12.12 17.53,9.84 18.15,9.21 C10.1 v18.41,9.07 | STM32.36 20.11,20.08 19.07,21.12 C7.1 | STM32.9 24.21,10.92 24.21,9.47 25,8.68 C11.1 | 25.24,8.19 25.26,8.17 | 25.26,8.17 25.13,8.17
  Top 0.406: R2.1 27.34,3.74 27.34,7.35 26.53,8.17 25.26,8.17 25.13,8.17
  Top 0.508: v15.62,10.47 v15.63,10.48 C8.1 15.88,10.28 MCP1.5 | v20.7,21.01 20.45,21.27 19.45,21.27 18.56,21.27 C7.1 | U4.15 U4.16 44.32,6.36 C16.1 44.23,5.06 43.59,4.42 | 32.04,3.28 32.17,3.16 R11.1 | 32.04,3.28 31.54,3.79 C5.1 31.62,6.36 U3.16 30.98,8.19 v30.35,8.82 30.99,9.46 U3.15 | 32.04,3.28 33.05,4.29 36.12,4.29 37.12,3.28 | 37.12,3.28 37.25,3.16 R12.1 | 37.12,3.28 38.13,4.29 41.4,4.29 R13.1 | R14.1 46.35,4.42 43.59,4.42 | 43.59,4.42 43.39,4.42 R13.1 | C11.1 25.24,8.19 | R13.1 42.33,3.28
  Top 1.016: v20.7,22.03 v20.7,21.01 | U$2.3 v10.92,32.95 10.92,32.7 v12.19,31.43
  Bottom 0.508: v24.89,8.19 26.92,10.21 29.34,10.21 30.35,9.21 v30.35,8.82
  Bottom 1.016: v24.89,8.19 24.89,9.84 24,10.72 | 24,10.72 20.45,10.72 18.8,9.07 v18.41,9.07 16.89,9.07 15.62,10.34 v15.62,10.47 | 21.59,21.01 v20.7,21.01 v20.7,22.03 | 24,10.72 28.7,15.42 v28.7,20.63 28.32,21.01 21.59,21.01 | v10.92,32.95 12.19,31.68 v12.19,31.43 18.92,31.43 19.68,30.66 19.68,23.04 v20.7,22.03 | v20.7,22.03 21.59,21.14 21.59,21.01
VPP
  Top 0.508: U1.5 28.68,25.64 27.99,26.33 24.71,26.33 C1.1 24.3,25.96 23.41,25.08 21.94,25.08 18.77,28.25 17.65,28.25 17.14,28.76 L1.1
  Top 1.016: L1.1 15.63,33.14 10.74,38.03 U$2.1
X_DATA
  Top 0.254: U3.12 30.96,13.92 STM32.16
X_SCK
  Top 0.254: U3.11 31.5,14.42 STM32.17
X_SIG+
  Top 0.508: LOAD_X.4 36.06,37.81 36.06,36.16 35.61,35.7 R4.2
X_SIG-
  Top 0.508: 40.59,35.7 R3.2 40.59,35.7 | LOAD_X.3 38.36,37.02 39.28,37.02 40.59,35.7
X_VDD
  Top 0.508: 39.2,10.72 41.1,8.82 T1.C | U3.3 C4.1 39.2,10.72 | 39.2,10.72 40.13,11.65 41.47,11.65 41.74,11.92 41.74,13.6 40.85,14.48 R5.2 40.85,14.58 41.79,15.52 41.79,17.81 42.45,18.47 42.45,37.2 41.62,38.03 LOAD_X.1
Y_DATA  (via drill 0.35)
  Top 0.254: STM32.21 27.03,16.44 v30.48,16.44 | v43.18,13.9 43.69,13.9 U4.12
  Bottom 0.254: v30.48,16.44 31.75,15.17 41.91,15.17 v43.18,13.9
Y_SCK  (via drill 0.35)
  Top 0.254: U4.11 43.81,14.54 v43.18,15.17 | v31.24,18.22 30.61,18.22 29.31,16.92 STM32.22
  Bottom 0.254: v31.24,18.22 31.37,18.34 40.77,18.34 43.18,15.93 v43.18,15.17
Y_SIG+
  Top 0.508: LOAD_Y.4 44.74,35.99 R8.2
Y_SIG-
  Top 0.508: LOAD_Y.3 47.46,36.81 48.38,36.81 49.48,35.7 R7.2
Y_VDD
  Top 0.508: 51.91,10.72 52.83,11.65 54.17,11.65 54.44,11.92 54.44,13.6 53.55,14.48 R9.2 54.61,15.59 54.61,16.97 54,17.58 53.47,17.58 52.74,18.31 52.74,18.85 52.74,18.98 52.74,34.66 49.37,38.03 LOAD_Y.1 | T2.C 53.04,8.19 52.79,8.44 52.79,9.84 51.91,10.72 | 51.91,10.72 C15.1 U4.3

### Text on the board
tNames: ERROR | A | B | C | D
bNames: A+ A- B+ B- | C+ C- D+ D- | V G + - | V G + -
tStop: WASA Rocket
bStop: RCS Module